# EAGLE schematic Powerbank (EAGLE 9.1.0)
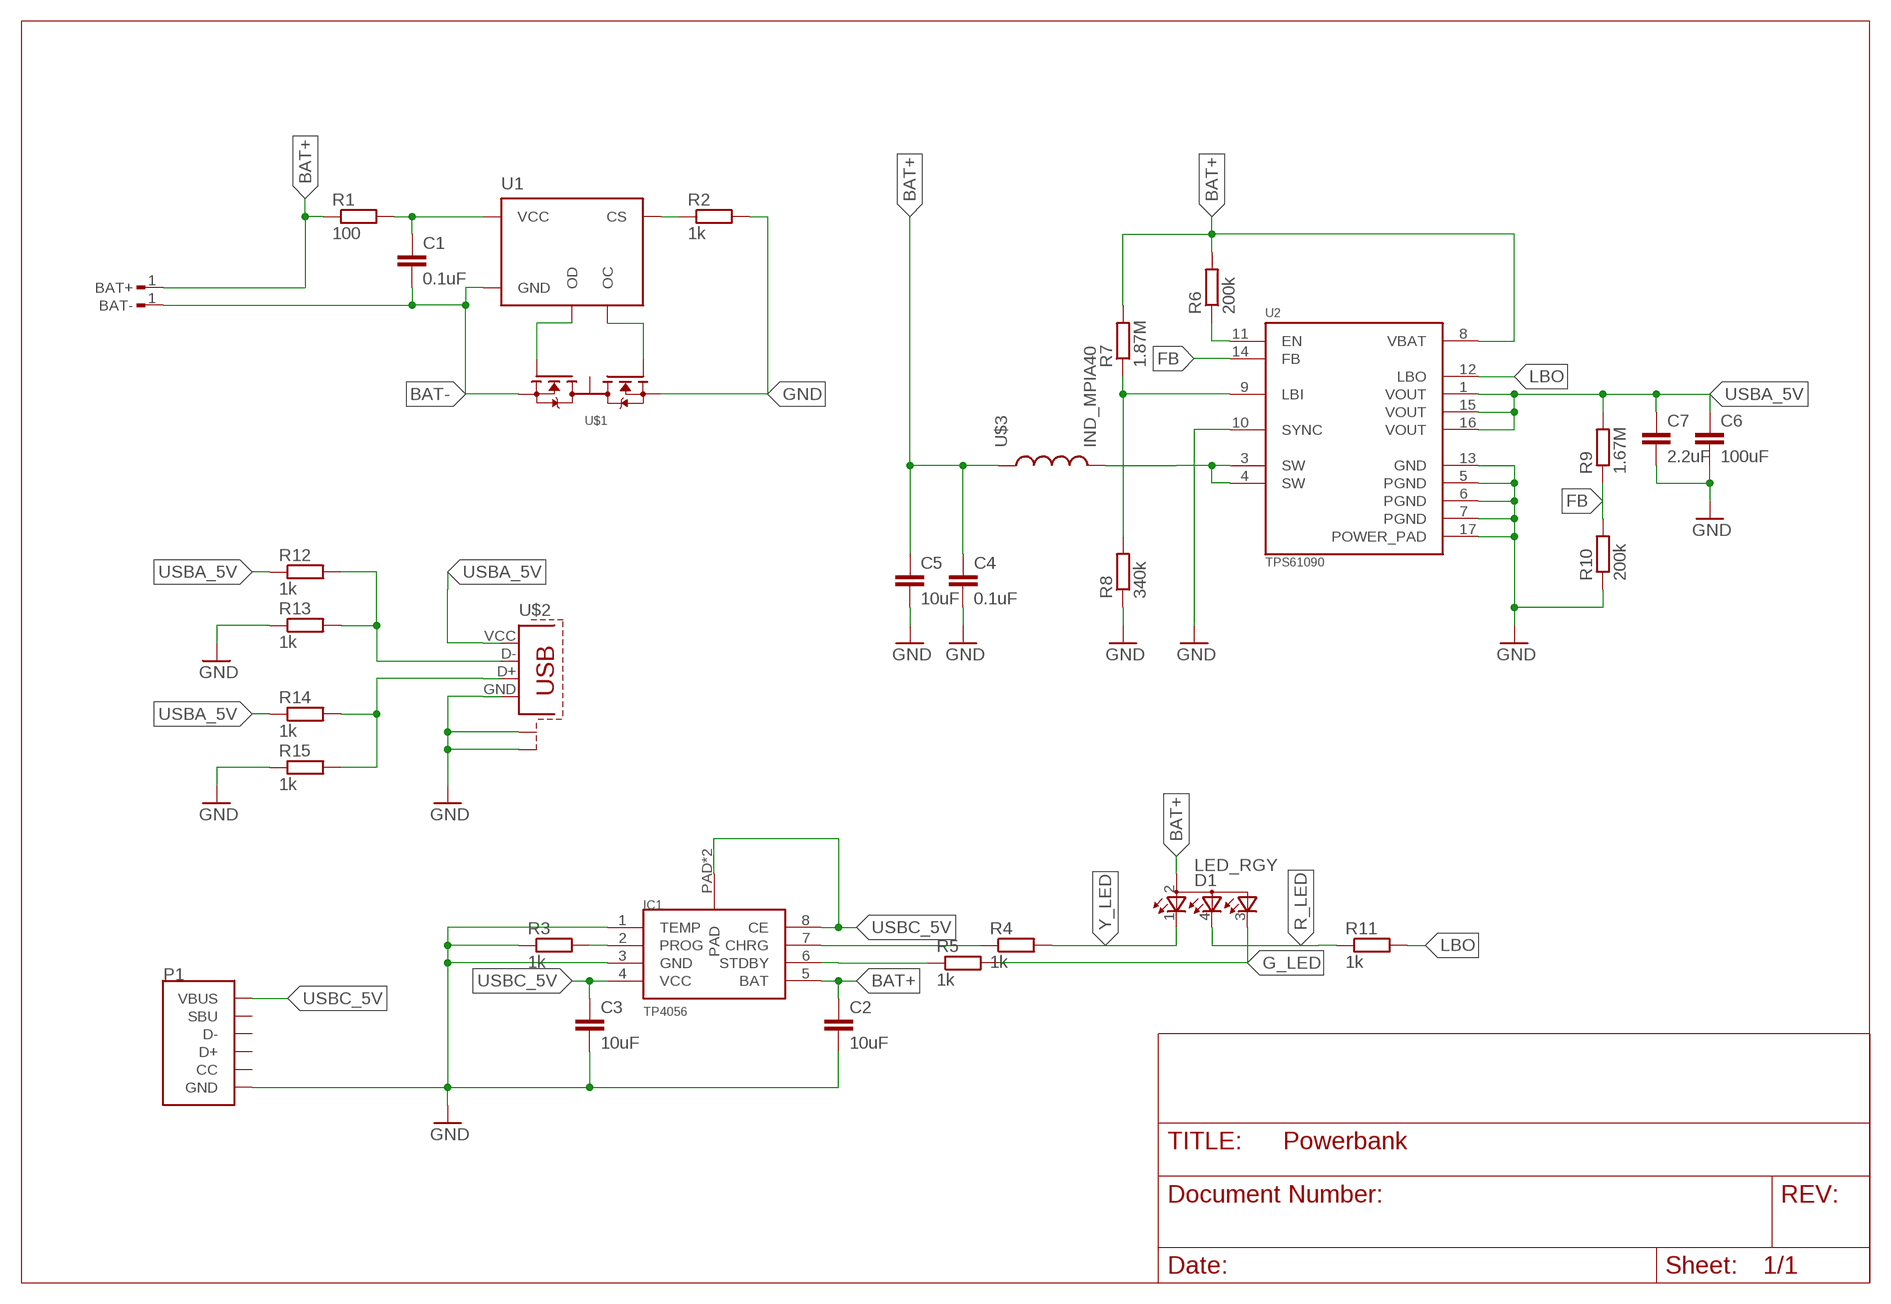
[diagram p0: schematic, sheet 1]

## Parts
BAT+  SOLDER_PAD  [SOLDER_PAD]
BAT-  SOLDER_PAD  [SOLDER_PAD]
C1  0.1uF  C-EUC0805  [C0805]
C2  10uF  C-EUC0805  [C0805]
C3  10uF  C-EUC0805  [C0805]
C4  0.1uF  C-EUC0805  [C0805]
C5  10uF  C-EUC0805  [C0805]
C6  100uF  C-EUC1210  [C1210]
C7  2.2uF  C-EUC0805  [C0805]
D1  LED_RGY  [LED_RGY]
IC1  TP4056  [SOP-8]
P1  TYPE-C  [TYPE-C]
R1  100  R-EU_R0805  [R0805]
R2  1k  R-EU_R0805  [R0805]
R3  1k  R-EU_R0805  [R0805]
R4  1k  R-EU_R0805  [R0805]
R5  1k  R-EU_R0805  [R0805]
R6  200k  R-EU_R0805  [R0805]
R7  1.87M  R-EU_R0805  [R0805]
R8  340k  R-EU_R0805  [R0805]
R9  1.67M  R-EU_R0805  [R0805]
R10  200k  R-EU_R0805  [R0805]
R11  1k  R-EU_R0805  [R0805]
R12  1k  R-EU_R0805  [R0805]
R13  1k  R-EU_R0805  [R0805]
R14  1k  R-EU_R0805  [R0805]
R15  1k  R-EU_R0805  [R0805]
U1  FS312F  [TSOT23-6]
U2  TPS61090  [QFN65P400X400X100-17N]
U$1  FS8205  [SOP65P640X120-8N]
U$2  USB_A_SMD_U  [USB_A_SMD_U]
U$3  IND_MPIA40  [IND_MPIA40]

## Nets
BAT+: BAT+.1 C2.1 C4.1 C5.1 D1.2(A) IC1.5(BAT) R1.1 R6.2 R7.2 U2.8(VBAT) U$3.P$1
BAT-: BAT-.1 C1.2 U1.6(GND) U$1.2(S1) U$1.3(S1)
FB: R9.1 R10.2 U2.14(FB)
G_LED: D1.3(GREEN) R5.2
GND: C2.2 C3.2 C4.2 C5.2 C6.2 C7.2 IC1.1(TEMP) IC1.3(GND) P1.A1/B12(GND) P1.B1/A12(GND) P1.P$1(GND) P1.P$2(GND) P1.P$3(GND) P1.P$4(GND) P1.P$5(GND) P1.P$6(GND) P1.P$7(GND) P1.P$8(GND) P1.P$9(GND) P1.P$10(GND) P1.P$11(GND) P1.P$12(GND) P1.P$13(GND) P1.P$14(GND) P1.P$15(GND) P1.P$16(GND) P1.P$17(GND) P1.P$18(GND) P1.P$19(GND) P1.P$20(GND) P1.P$21(GND) P1.P$22(GND) P1.P$23(GND) P1.P$24(GND) P1.P$25(GND) P1.P$26(GND) P1.P$27(GND) P1.P$28(GND) P1.P$29(GND) P1.P$30(GND) P1.P$31(GND) P1.P$32(GND) P1.P$33(GND) P1.P$34(GND) P1.P$35(GND) P1.P$36(GND) P1.P$37(GND) P1.P$38(GND) R2.2 R3.1 R8.1 R10.1 R13.1 R15.1 U2.5(PGND) U2.6(PGND) U2.7(PGND) U2.10(SYNC) U2.13(GND) U2.17(POWER_PAD) U$1.6(S2) U$1.7(S2) U$2.GND U$2.P$2(S1) U$2.P$6(S2)
LBO: R11.2 U2.12(LBO)
N$1: C1.1 R1.2 U1.5(VCC)
N$2: IC1.2(PROG) R3.2
N$3: IC1.7(CHRG) R4.1
N$4: U1.1(OD) U$1.4(G1)
N$5: U1.3(OC) U$1.5(G2)
N$6: R2.1 U1.2(CS)
N$7: IC1.6(STDBY) R5.1
N$8: R6.1 U2.11(EN)
N$9: U2.3(SW) U2.4(SW) U$3.P$2
N$10: R7.1 R8.2 U2.9(LBI)
N$13: R14.2 R15.2 U$2.D+
N$14: R12.2 R13.2 U$2.D-
R_LED: D1.4(YELLOW) R11.1
USBA_5V: C6.1 C7.1 R9.2 R12.1 R14.1 U2.1(VOUT) U2.15(VOUT) U2.16(VOUT) U$2.VCC
USBC_5V: C3.1 IC1.4(VCC) IC1.8(CE) IC1.PAD IC1.PAD2(PAD) P1.A4/B9(VBUS) P1.B4/A9(VBUS)
Y_LED: D1.1(RED) R4.2
Unconnected: P1.A5(CC) P1.A6(D+) P1.A7(D-) P1.A8(SBU) P1.B5(CC) P1.B6(D+) P1.B7(D-) P1.B8(SBU) U$1.1(D12) U$1.8(D12)

## Library data of the parts
BAT+ BAT- = Powerbank:SOLDER_PAD
C1-C7 = rcl:C-EU: CAPACITOR, European symbol; SPICEPREFIX: C
D1 = Powerbank:LED_RGY
IC1 = Library für Stefan:TP4056
P1 = Library für Stefan:TYPE-C
R1-R15 = rcl:R-EU_: RESISTOR, European symbol; SPICEPREFIX: R
U1 = Library für Stefan:FS312F
U2 = TPS61090:TPS61090: TPS6109x Synchronous Boost Converter With 2-A Switch; AVAILABILITY: Unavailable; DESCRIPTION: the tps6109x devices provide a power supply solution for products powered by either a one-cell li-ion or li-polymer o...; MF: Texas Instruments; MP: TPS61090; PACKAGE: QFN-16 Texas Instruments; PRICE: None
U$1 = Library für Stefan:FS8205
U$2 = Powerbank:USB_A_SMD_U
U$3 = Powerbank:IND_MPIA40